# EAGLE design 4 layerer PCB Electronics Design (EAGLE 9.7.0)
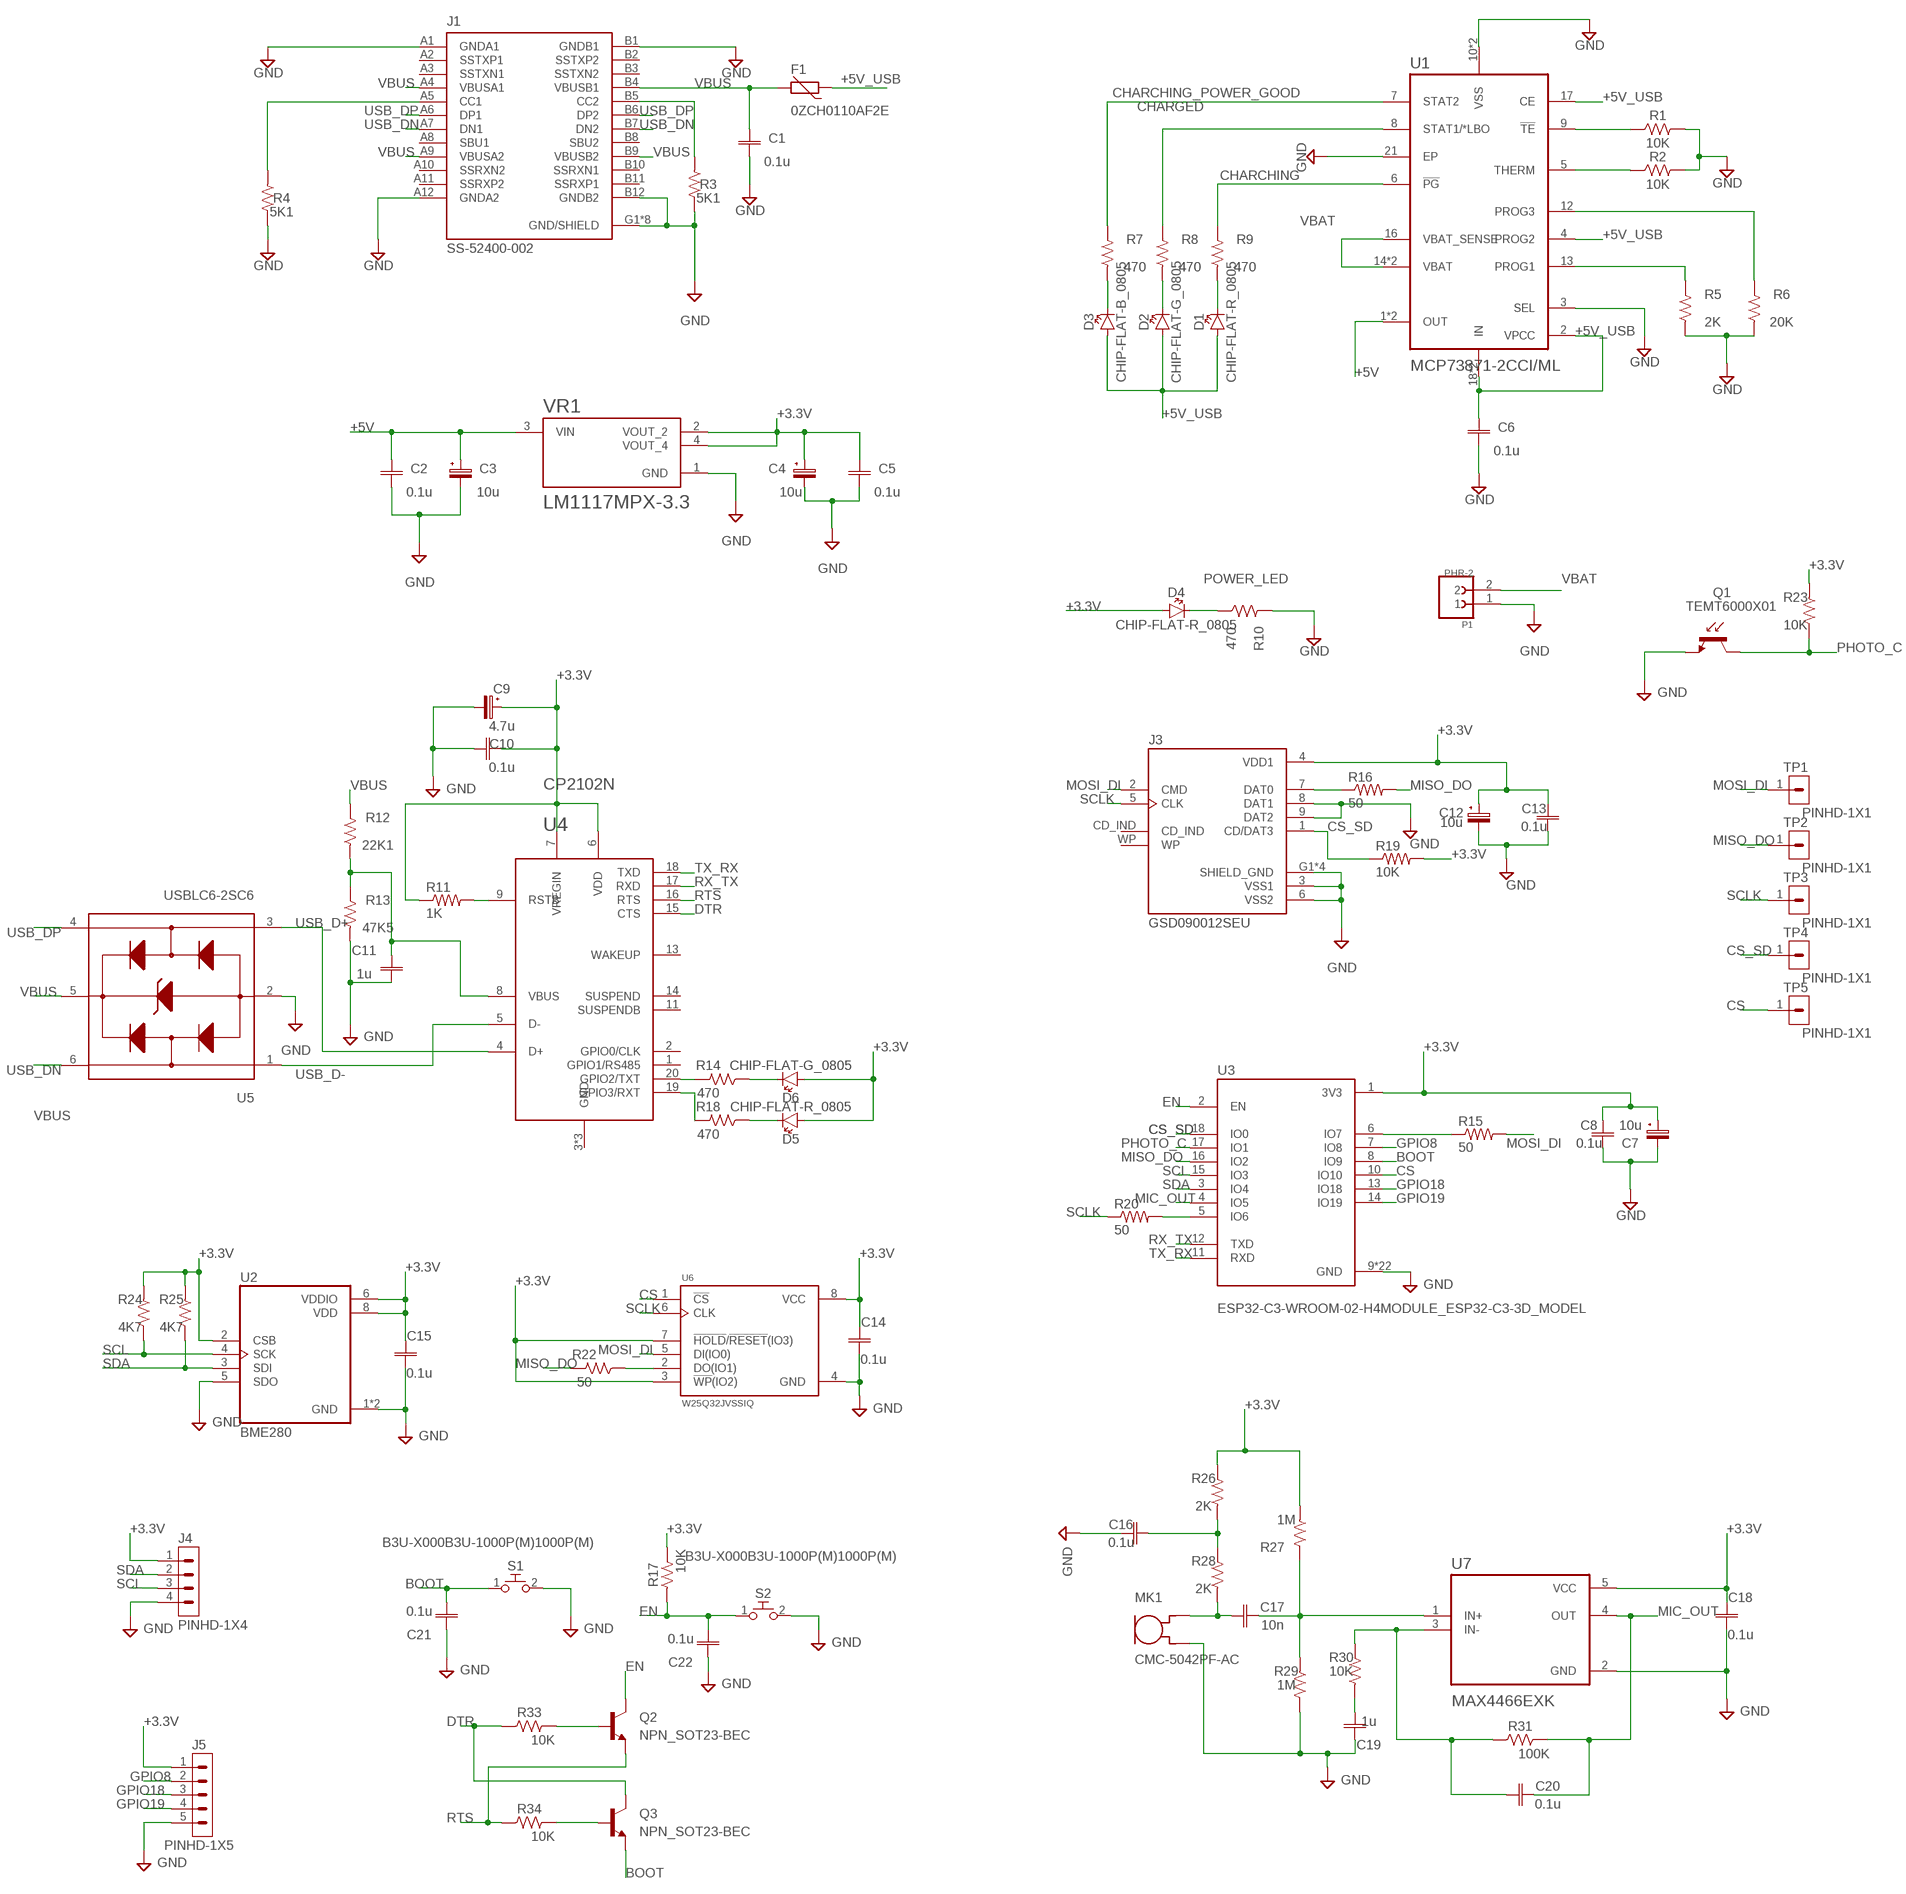
[diagram p0: schematic, sheet 1]

## Parts
C1  0.1u  C_CHIP-0805(2012-METRIC)  [CAPC2012X110]
C2  0.1u  C_CHIP-0805(2012-METRIC)  [CAPC2012X110]
C3  10u  C-POL_TANTALUM-1206(3216-METRIC)  [CAPMP3216X180N]
C4  10u  C-POL_TANTALUM-1206(3216-METRIC)  [CAPMP3216X180N]
C5  0.1u  C_CHIP-0805(2012-METRIC)  [CAPC2012X110]
C6  0.1u  C_CHIP-0805(2012-METRIC)  [CAPC2012X110]
C7  10u  C-POL_TANTALUM-1206(3216-METRIC)  [CAPMP3216X180N]
C8  0.1u  C_CHIP-0805(2012-METRIC)  [CAPC2012X110]
C9  4.7u  C-POL_TANTALUM-1206(3216-METRIC)  [CAPMP3216X180N]
C10  0.1u  C_CHIP-0805(2012-METRIC)  [CAPC2012X110]
C11  1u  C_CHIP-0805(2012-METRIC)  [CAPC2012X110]
C12  10u  C-POL_TANTALUM-1206(3216-METRIC)  [CAPMP3216X180N]
C13  0.1u  C_CHIP-0805(2012-METRIC)  [CAPC2012X110]
C14  0.1u  C_CHIP-0805(2012-METRIC)  [CAPC2012X110]
C15  0.1u  C_CHIP-0805(2012-METRIC)  [CAPC2012X110]
C16  0.1u  C_CHIP-0805(2012-METRIC)  [CAPC2012X110]
C17  10n  C_CHIP-0805(2012-METRIC)  [CAPC2012X110]
C18  0.1u  C_CHIP-0805(2012-METRIC)  [CAPC2012X110]
C19  1u  C_CHIP-0805(2012-METRIC)  [CAPC2012X110]
C20  0.1u  C_CHIP-0805(2012-METRIC)  [CAPC2012X110]
C21  0.1u  C_CHIP-0805(2012-METRIC)  [CAPC2012X110]
C22  0.1u  C_CHIP-0805(2012-METRIC)  [CAPC2012X110]
D1  CHIP-FLAT-R_0805  [LEDC2012X110N_FLAT-R]
D2  CHIP-FLAT-G_0805  [LEDC2012X110N_FLAT-G]
D3  CHIP-FLAT-B_0805  [LEDC2012X110N_FLAT-B]
D4  CHIP-FLAT-R_0805  [LEDC2012X110N_FLAT-R]
D5  CHIP-FLAT-R_0805  [LEDC2012X110N_FLAT-R]
D6  CHIP-FLAT-G_0805  [LEDC2012X110N_FLAT-G]
F1  0ZCH0110AF2E  [FUSC3225X100N]
J1  SS-52400-002  [BELFUSE_SS-52400-002]
J3  GSD090012SEU  [AMPHENOL_GSD090012SEU]
J4  PINHD-1X4  [1X04]
J5  PINHD-1X5  [1X05]
MK1  CMC-5042PF-AC  [CUI_CMC-5042PF-AC]
P1  PHR-2  [JST_PHR-2]
Q1  TEMT6000X01  [1206_TEMT6000X01]
Q2  NPN_SOT23-BEC  [SOT95P237X112-3N]
Q3  NPN_SOT23-BEC  [SOT95P237X112-3N]
R1  10K  R-US_CHIP-0805(2012-METRIC)  [RESC2012X65]
R2  10K  R-US_CHIP-0805(2012-METRIC)  [RESC2012X65]
R3  5K1  R-US_CHIP-0805(2012-METRIC)  [RESC2012X65]
R4  5K1  R-US_CHIP-0805(2012-METRIC)  [RESC2012X65]
R5  2K  R-US_CHIP-0805(2012-METRIC)  [RESC2012X65]
R6  20K  R-US_CHIP-0805(2012-METRIC)  [RESC2012X65]
R7  470  R-US_CHIP-0805(2012-METRIC)  [RESC2012X65]
R8  470  R-US_CHIP-0805(2012-METRIC)  [RESC2012X65]
R9  470  R-US_CHIP-0805(2012-METRIC)  [RESC2012X65]
R10  470  R-US_CHIP-0805(2012-METRIC)  [RESC2012X65]
R11  1K  R-US_R0805  [R0805]
R12  22K1  R-US_CHIP-0805(2012-METRIC)  [RESC2012X65]
R13  47K5  R-US_CHIP-0805(2012-METRIC)  [RESC2012X65]
R14  470  R-US_CHIP-0805(2012-METRIC)  [RESC2012X65]
R15  50  R-US_R0805  [R0805]
R16  50  R-US_R0805  [R0805]
R17  10K  R-US_CHIP-0805(2012-METRIC)  [RESC2012X65]
R18  470  R-US_CHIP-0805(2012-METRIC)  [RESC2012X65]
R19  10K  R-US_R0805  [R0805]
R20  50  R-US_R0805  [R0805]
R22  50  R-US_CHIP-0805(2012-METRIC)  [RESC2012X65]
R23  10K  R-US_CHIP-0805(2012-METRIC)  [RESC2012X65]
R24  4K7  R-US_CHIP-0805(2012-METRIC)  [RESC2012X65]
R25  4K7  R-US_CHIP-0805(2012-METRIC)  [RESC2012X65]
R26  2K  R-US_CHIP-0805(2012-METRIC)  [RESC2012X65]
R27  1M  R-US_CHIP-0805(2012-METRIC)  [RESC2012X65]
R28  2K  R-US_CHIP-0805(2012-METRIC)  [RESC2012X65]
R29  1M  R-US_CHIP-0805(2012-METRIC)  [RESC2012X65]
R30  10K  R-US_CHIP-0805(2012-METRIC)  [RESC2012X65]
R31  100K  R-US_CHIP-0805(2012-METRIC)  [RESC2012X65]
R33  10K  R-US_CHIP-0805(2012-METRIC)  [RESC2012X65]
R34  10K  R-US_CHIP-0805(2012-METRIC)  [RESC2012X65]
S1  B3U-X000B3U-1000P(M)1000P(M)  [B3U-1000P(M)]
S2  B3U-X000B3U-1000P(M)1000P(M)  [B3U-1000P(M)]
TP1  PINHD-1X1  [1X01]
TP2  PINHD-1X1  [1X01]
TP3  PINHD-1X1  [1X01]
TP4  PINHD-1X1  [1X01]
TP5  PINHD-1X1  [1X01]
U1  MCP73871-2CCI/ML  [QFN50P400X400X100-21N]
U2  BME280  [PSON65P250X250X100-8N]
U3  ESP32-C3-WROOM-02-H4MODULE_ESP32-C3-3D_MODEL  [MODULE_ESP32-C3-WROOM-02-H4]
U4  CP2102N-A02-GQFN20  [WFQFN-20]
U5  USBLC6-2SC6  [SOT95P280X145-6N]
U6  W25Q32JVSSIQ  [SOIC127P790X216-8N]
U7  MAX4466EXK  [SOT65P210X110-5N]
VR1  LM1117MPX-3.3  [VREG_LM1117MPX-3.3]

## Nets
+3.3V [3.3V]: C4.1(+) C5.1 C7.1(+) C8.2 C9.1(+) C10.1 C12.1(+) C13.2 C14.1 C15.1 C18.1 D4.A D5.A D6.A J3.4(VDD1) J4.1 J5.1 R11.1 R17.2 R19.2 R23.1 R24.1 R25.1 R26.2 R27.1 U2.2(CSB) U2.6(VDDIO) U2.8(VDD) U3.1(3V3) U4.6(VDD) U4.7(VREGIN) U6.3(!WP!(IO2)) U6.7(!HOLD!/!RESET!(IO3)) U6.8(VCC) U7.5(VCC) VR1.2(VOUT_2) VR1.4(VOUT_4)
+5V [5V_USB]: C2.1 C3.1(+) U1.1(OUT) U1.20(OUT) VR1.3(VIN)
+5V_USB [5V_USB]: C6.1 D1.A D2.A D3.A F1.1 U1.2(VPCC) U1.4(PROG2) U1.17(CE) U1.18(IN) U1.19(IN)
BOOT [control]: C21.1 Q3.2(E) S1.1 U3.8(IO9)
CHARCHING: R9.2 U1.6(!PG)
CHARCHING_POWER_GOOD: R7.2 U1.7(STAT2)
CHARGED: R8.2 U1.8(STAT1/*LBO)
CS [SPI]: TP5.1 U3.10(IO10) U6.1(!CS)
CS_SD: J3.1(CD/DAT3) R19.1 TP4.1 U3.18(IO0)
DTR: Q3.3(C) R33.1 U4.15(CTS)
EN [control]: C22.1 Q2.3(C) R17.1 S2.1 U3.2(EN)
GND [GND]: C1.2 C2.2 C3.2(-) C4.2(-) C5.2 C6.2 C7.2(-) C8.1 C9.2(-) C10.2 C11.2 C12.2(-) C13.1 C14.2 C15.2 C16.1 C18.2 C19.2 C21.2 C22.2 J1.A1(GNDA1) J1.A12(GNDA2) J1.B1(GNDB1) J1.B12(GNDB2) J1.G1(GND/SHIELD) J1.G2(GND/SHIELD) J1.G3(GND/SHIELD) J1.G4(GND/SHIELD) J1.S1(GND/SHIELD) J1.S2(GND/SHIELD) J1.S3(GND/SHIELD) J1.S4(GND/SHIELD) J3.3(VSS1) J3.6(VSS2) J3.8(DAT1) J3.9(DAT2) J3.G1(SHIELD_GND) J3.G2(SHIELD_GND) J3.G3(SHIELD_GND) J3.G4(SHIELD_GND) J4.4 J5.5 MK1.GND P1.1 Q1.P$1(E) R1.2 R2.2 R3.2 R4.2 R5.1 R6.1 R10.2 R13.1 R29.2 S1.2 S2.2 U1.3(SEL) U1.10(VSS) U1.11(VSS) U1.21(EP) U2.1(GND) U2.5(SDO) U2.7(GND) U3.9(GND) U3.19(GND) U3.20(GND) U3.21(GND) U3.22(GND) U3.23(GND) U3.24(GND) U3.25(GND) U3.26(GND) U3.27(GND) U3.28(GND) U3.29(GND) U3.30(GND) U3.31(GND) U3.32(GND) U3.33(GND) U3.34(GND) U3.35(GND) U3.36(GND) U3.37(GND) U3.38(GND) U3.39(GND) U5.2(GND) U6.4(GND) U7.2(GND) VR1.1(GND)
GPIO8 [GPIO]: J5.2 U3.7(IO8)
GPIO18 [GPIO]: J5.3 U3.13(IO18)
GPIO19 [GPIO]: J5.4 U3.14(IO19)
MIC_OUT: C20.2 R31.2 U3.4(IO5) U7.4(OUT)
MISO_DO [SPI]: R16.2 R22.2 TP2.1 U3.16(IO2)
MOSI_DI [SPI]: J3.2(CMD) R15.2 TP1.1 U6.5(DI(IO0))
N$1: J1.B5(CC2) R3.1
N$2: J1.A5(CC1) R4.1
N$3: R1.1 U1.9(!TE)
N$4: R6.2 U1.12(PROG3)
N$5: R2.1 U1.5(THERM)
N$6: R5.2 U1.13(PROG1)
N$7: R11.2 U4.9(RSTB)
N$8: D6.C R14.1
N$9: C11.1 R12.1 R13.2 U4.8(VBUS)
N$10: D3.C R7.1
N$11: D2.C R8.1
N$12: R15.1 U3.6(IO7)
N$13: D1.C R9.1
N$14 [GND]: C20.1 R30.2 R31.1 U7.3(IN-)
N$15: D5.C R18.1
N$16: R14.2 U4.20(GPIO2/TXT)
N$17: R18.2 U4.19(GPIO3/RXT)
N$18: Q2.1(B) R33.2
N$19: R20.2 U3.5(IO6)
N$20: Q3.1(B) R34.2
N$21: C16.2 R26.1 R28.2
N$22: J3.7(DAT0) R16.1
N$23: C17.2 R27.2 R29.1 U7.1(IN+)
N$24: C17.1 MK1.OUT R28.1
N$25: R22.1 U6.2(DO(IO1))
N$26: C19.1 R30.1
PHOTO_C: Q1.P$3(C) R23.2 U3.17(IO1)
POWER_LED: D4.C R10.1
RTS [control]: Q2.2(E) R34.1 U4.16(RTS)
RX_TX: U3.12(TXD) U4.17(RXD)
SCL [I2C]: J4.3 R24.2 U2.4(SCK) U3.15(IO3)
SCLK [SPI]: J3.5(CLK) R20.1 TP3.1 U6.6(CLK)
SDA [I2C]: J4.2 R25.2 U2.3(SDI) U3.3(IO4)
TX_RX: U3.11(RXD) U4.18(TXD)
USB_D+ [USB_data]: U4.4(D+) U5.3(I/O2_IN)
USB_D- [USB_data]: U4.5(D-) U5.1(I/O1_IN)
USB_DN [USB_data]: J1.A7(DN1) J1.B7(DN2) U5.6(I/O1_OUT)
USB_DP [USB_data]: J1.A6(DP1) J1.B6(DP2) U5.4(I/O2_OUT)
VBAT [VBUS]: P1.2 U1.14(VBAT) U1.15(VBAT) U1.16(VBAT_SENSE)
VBUS [VBUS]: C1.1 F1.2 J1.A4(VBUSA1) J1.A9(VBUSA2) J1.B4(VBUSB1) J1.B9(VBUSB2) R12.2 U5.5(VBUS)
Unconnected: J1.A2(SSTXP1) J1.A3(SSTXN1) J1.A8(SBU1) J1.A10(SSRXN2) J1.A11(SSRXP2) J1.B2(SSTXP2) J1.B3(SSTXN2) J1.B8(SBU2) J1.B10(SSRXN1) J1.B11(SSRXP1) J3.CD_IND J3.WP U4.1(GPIO1/RS485) U4.2(GPIO0/CLK) U4.3(GND) U4.11(SUSPENDB) U4.12(GND) U4.13(WAKEUP) U4.14(SUSPEND) U4.GND

## Library data of the parts
C1 C2 C5 C6 C8 C10 C11 C13-C22 = Capacitor:C: Capacitor - Generic
C3 C4 C7 C9 C12 = Capacitor:C-POL: Capacitor Polarised - Generic
D1 D4 D5 = LED:CHIP-FLAT-R: Red LED - Generic
D2 D6 = LED:CHIP-FLAT-G: Green LED - Generic
D3 = LED:CHIP-FLAT-B: Blue LED - Generic
F1 = 0ZCH0110AF2E:0ZCH0110AF2E: Check availability <https://pricing.snapeda.com/parts/0ZCH0110AF2E/Bel%20Fuse%20Inc./view-part?ref=eda>
J1 = SS-52400-002:SS-52400-002: Check availability <https://pricing.snapeda.com/parts/SS-52400-002/Stewart%20Connector/view-part?ref=eda>
J3 = GSD090012SEU:GSD090012SEU: Check availability <https://pricing.snapeda.com/parts/GSD090012SEU/Amphenol%20FCI/view-part?ref=eda>
J4 = Connector:PINHD-1X4: Pin Header
J5 = Connector:PINHD-1X5: Pin Header
MK1 = CMC-5042PF-AC:CMC-5042PF-AC: Check availability <https://pricing.snapeda.com/parts/CMC-5042PF-AC/Same%20Sky/view-part?ref=eda>
P1 = PHR-2:PHR-2: Check availability <https://pricing.snapeda.com/parts/PHR-2/JST%20Sales/view-part?ref=eda>
Q1 = Sensor:TEMT6000X01: Ambient Light Sensor Datasheet <https://www.vishay.com/docs/81579/temt6000.pdf>
Q2 Q3 = Transistor:NPN: NPN Transistor - Generic
R1-R10 R12-R14 R17 R18 R22-R31 R33 R34 = Resistor:R-US: Resistor Fixed - ANSI
R11 R15 R16 R19 R20 = AtoZ v7:R-US_: RESISTOR, American symbol
S1 S2 = Switch:B3U-X000: Ultra-small Tactile Switch Contact form : SPST-NO Reference: Datasheet <https://omronfs.omron.com/en_US/ecb/products/pdf/en-b3u.pdf>
TP1-TP5 = Connector:PINHD-1X1: Pin Header
U1 = MCP73871-2CCI_ML:MCP73871-2CCI/ML: Check availability <https://pricing.snapeda.com/parts/MCP73871-2CCI/ML/Microchip%20Technology/view-part?ref=eda>
U2 = BME280:BME280: Check availability <https://pricing.snapeda.com/parts/BME280/Bosch/view-part?ref=eda>
U3 = ESP32-C3-WROOM-02-H4:ESP32-C3-WROOM-02-H4: Check availability <https://pricing.snapeda.com/parts/ESP32-C3-WROOM-02-H4/Espressif%20Systems/view-part?ref=eda>
U4 = CP2102N-A02-GQFN20:CP2102N-A02-GQFN20: Check availability <https://pricing.snapeda.com/parts/CP2102N-A02-GQFN20/Silicon%20Labs/view-part?ref=eda>
U5 = USBLC6-2SC6:USBLC6-2SC6: Check availability <https://pricing.snapeda.com/parts/USBLC6-2SC6/STMicroelectronics/view-part?ref=eda>
U6 = W25Q32JVSSIQ:W25Q32JVSSIQ: Check availability <https://pricing.snapeda.com/parts/W25Q32JVSSIQ/Winbond/view-part?ref=eda>
U7 = MAX4466EXK:MAX4466EXK: Check availability <https://pricing.snapeda.com/parts/MAX4466EXK%2BT/Maxim%20Integrated%20Products/view-part?ref=eda>
VR1 = LM1117MPX-3.3:LM1117MPX-3.3: Check availability <https://pricing.snapeda.com/parts/LM1117MPX-3.3/Texas%20Instruments/view-part?ref=eda>

## Net classes
3 VBUS: width 0.5 mm
4 USB_data: width 0.25 mm
9 5V_USB: width 0.5 mm
10 3.3V: width 0.3 mm

## Board
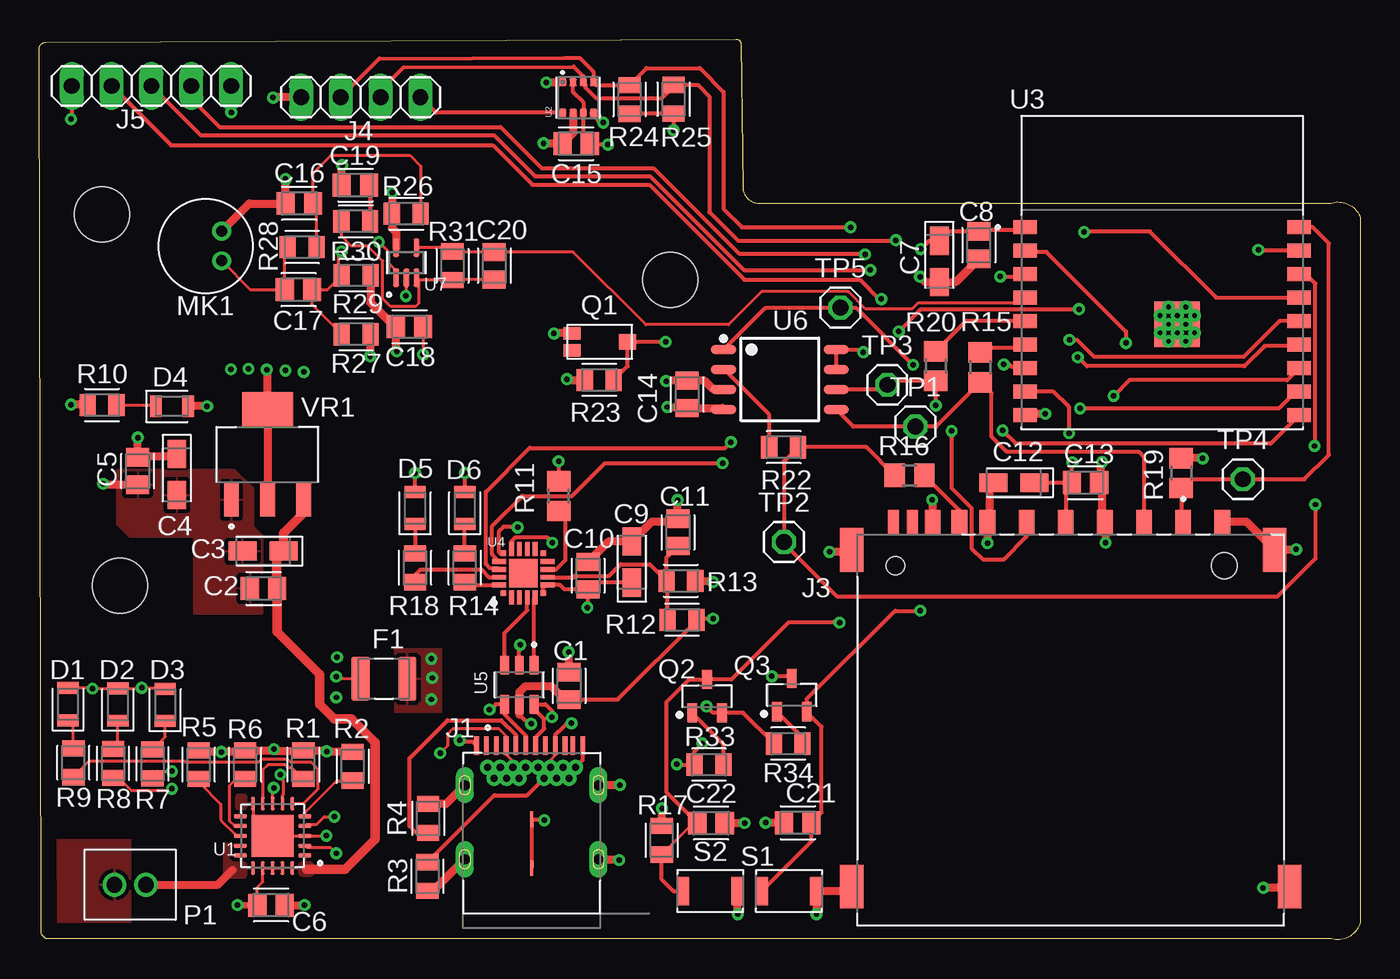
[diagram p1: board, top side]
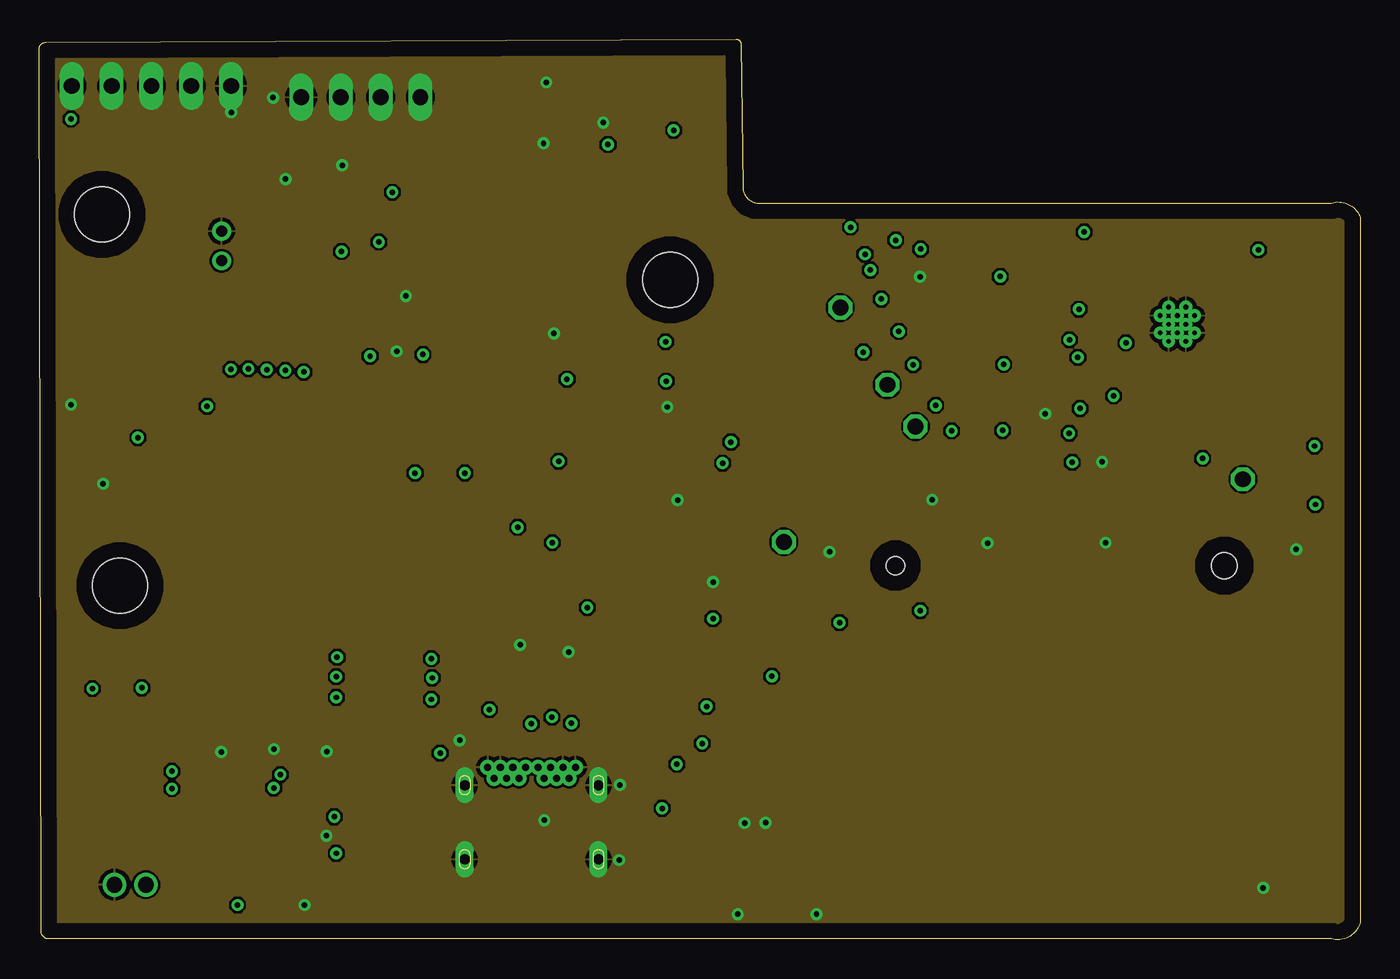
[diagram p2: board, inner layer Route2]
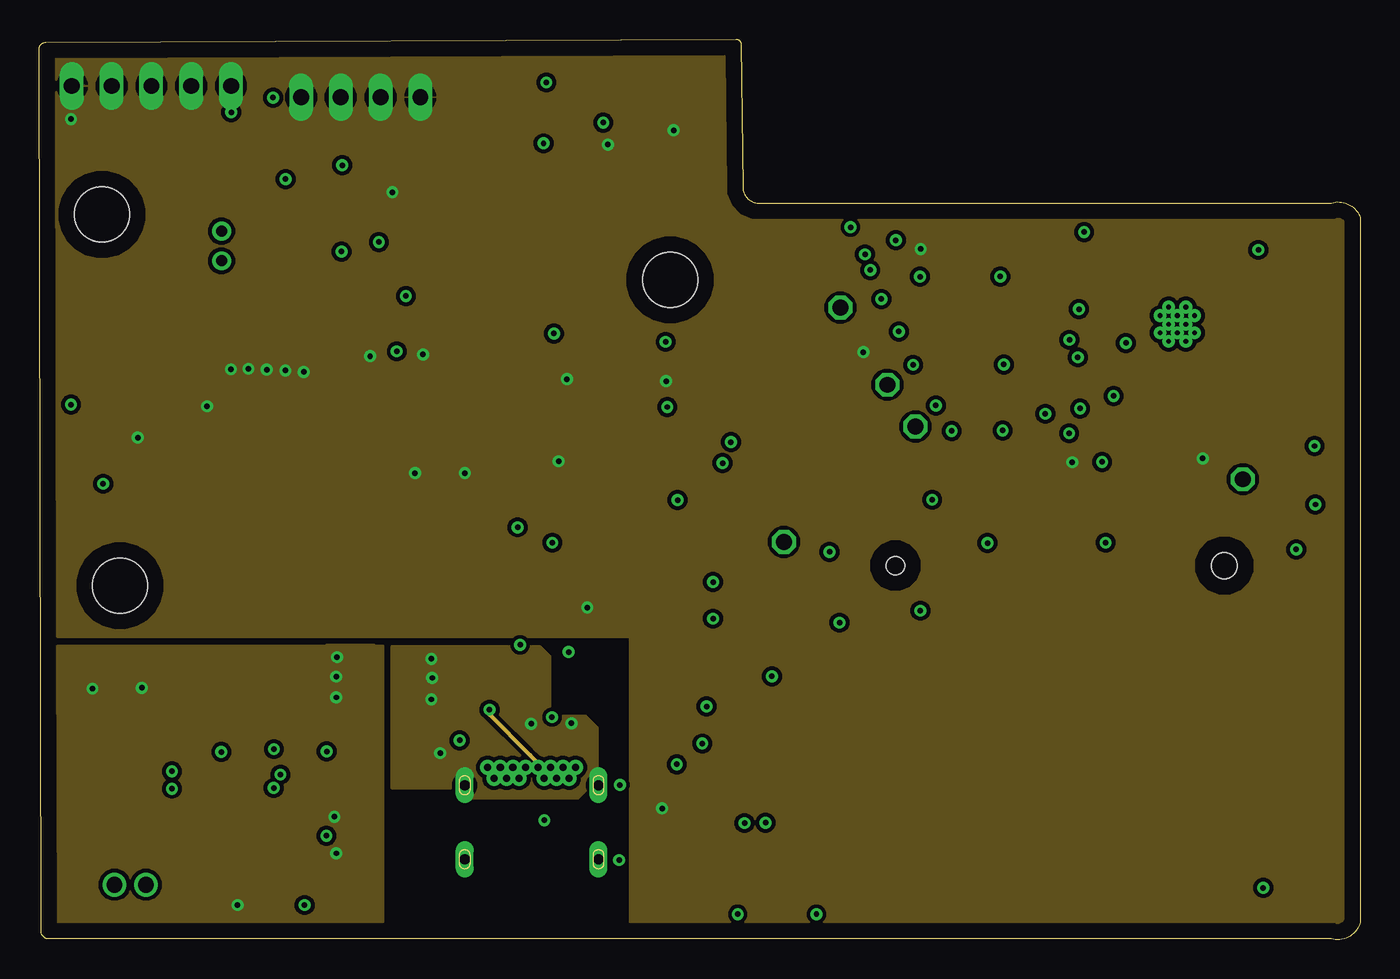
[diagram p3: board, inner layer Route63]
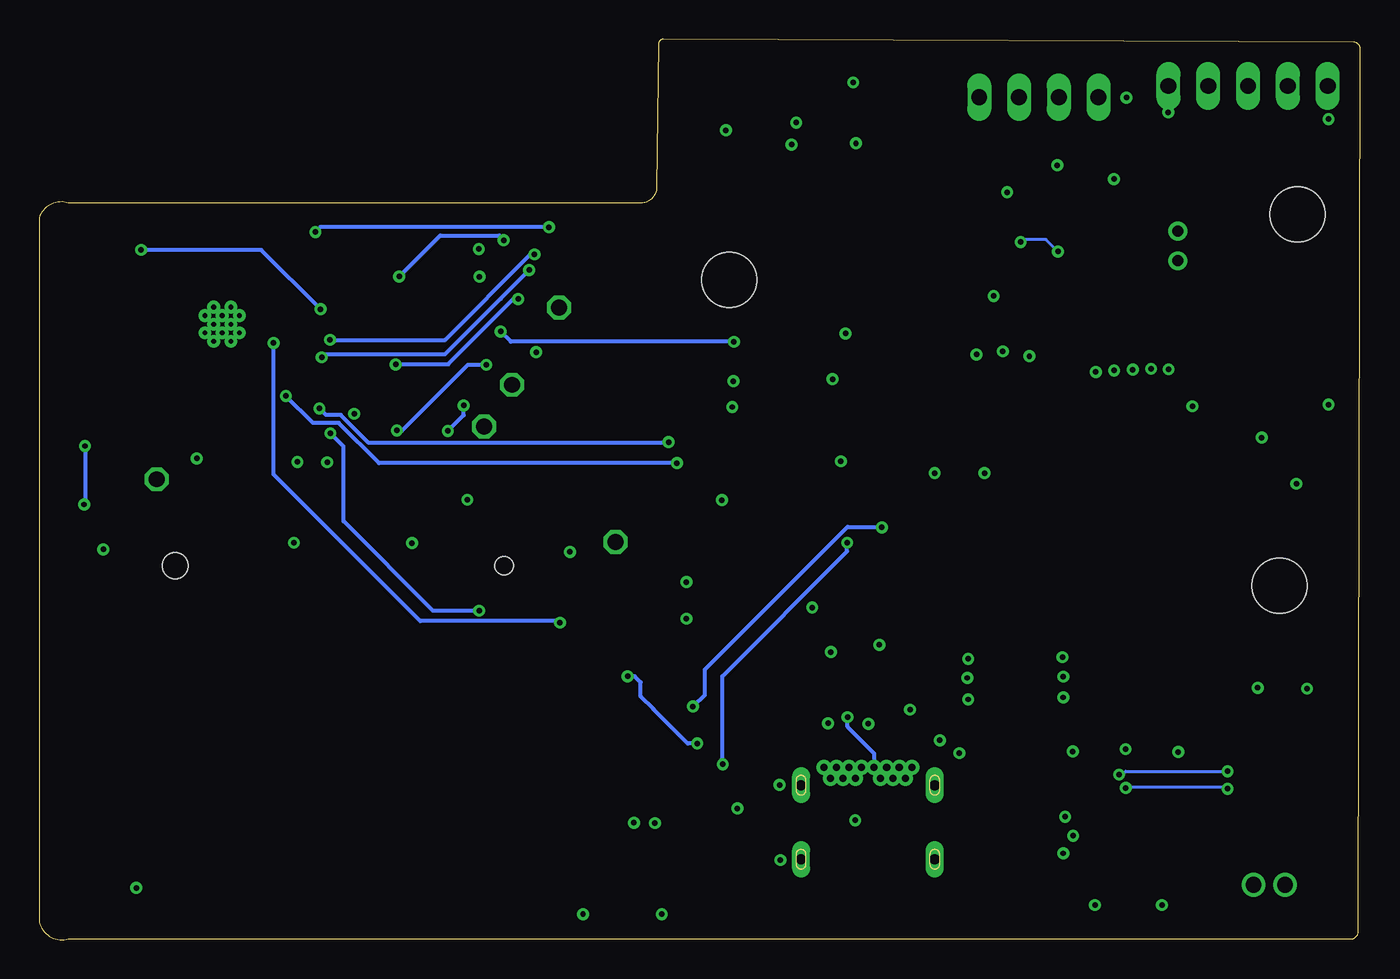
[diagram p4: board, bottom side, seen from below]

Size 84.36 x 57.51 mm. Coordinates in mm from the lower left corner, seen from the top.
Outline: 45.94,47.05 82.49,47.05 arc-90 84.36,46.1 84.36,1.11 arc-90 82.49,0.06 0.6,0.06 arc-90 0.13,0.52 0.13,0.85 0,56.87 arc-90 0.43,57.31 44.5,57.51 arc-89 44.81,57.2 44.94,48.05 arc90 45.94,47.05
Copper layers (1+2*15+16): Top / Route2 / Route63 / Bottom
Stack-up 4 Layer Stack: Top SilkScreen Epoxy Ink / Top SolderMask SR:Green 0.0254mm Dk 4.3 / Top Surface Finish Lead-Free 0.02mm / Top CuFoil:007 0.035mm / Dielectric-1 Prepreg:001 0.064mm / Dielectric-2 Prepreg:001 0.064mm / Route2 CuFoil:007 0.035mm / Dielectric-3 Core:066 0.711mm / Route63 CuFoil:007 0.035mm / Dielectric-4 Prepreg:001 0.064mm / Dielectric-5 Prepreg:001 0.064mm / Bottom CuFoil:007 0.035mm / Bottom Surface Finish Lead-Free 0.02mm / Bottom SolderMask SR:Green 0.0254mm Dk 4.3 / Bottom SilkScreen Epoxy Ink
Design rules: minimum copper width all 0.2mm, minimum copper width classes=3,9 0.5mm, minimum copper width classes=10 0.3mm, minimum copper width classes=4 0.25mm, minimum copper width 6mil, minimum drill size 0.35mm, copper clearance component=J1 to component=J1 4mil, copper clearance all to all 3mil, copper clearance classes=3,9 to all 0.25mm, copper clearance component=J1 to component=J1 (same net) 0mil, copper clearance wire_polygon to wire_polygon 6mil, copper clearance wire_polygon to pad_smd 6mil, copper clearance wire_polygon to via 6mil, copper clearance pad_smd to pad_smd 6mil, copper clearance pad_smd to via 6mil, copper clearance via to via 6mil, copper clearance smd to pad (same net) 6mil, copper clearance smd to via (same net) 6mil, copper clearance smd to smd (same net) 6mil, dimension clearance 40mil, via restrict clearance 0mil, restrict clearance 0mil, drill distance 6mil, keepout clearance 0mil
Holes 3.5 mm at 4.01,46.31 5.16,22.61 40.28,42.14

### Footprints (pad centres in the part's own frame; a part is rotated, then mirrored left to right if it is on the bottom)
CAPC2012X110 = smd 1.165 x 1.465: 1 -0.875,0; 2 0.875,0
CAPMP3216X180N = smd 1.796 x 1.189: 1 -1.31,0; 2 1.31,0
LEDC2012X110N_FLAT-R = smd 0.762 x 1.362: A 1.025,0; C -1.025,0
LEDC2012X110N_FLAT-G = smd 0.762 x 1.362: A 1.025,0; C -1.025,0
LEDC2012X110N_FLAT-B = smd 0.762 x 1.362: A 1.025,0; C -1.025,0
FUSC3225X100N = smd 1.18 x 2.81: 1 -1.485,0; 2 1.485,0
BELFUSE_SS-52400-002 = smd 0.3 x 1.2: A1 -3.512,7.257; A2 -2.885,7.257; A3 -2.258,7.257; A4 -1.631,7.257; A5 -1.004,7.257; A6 -0.377,7.257; A7 0.25,7.257; A8 0.877,7.257; A9 1.504,7.257; A10 2.131,7.257; A11 2.631,7.257; A12 3.258,7.257 | drill 0.45 pad 0.65: B1 2.8,5.88; B2 2.4,5.17; B3 1.6,5.17; B4 1.2,5.88; B5 0.8,5.17; B6 0.4,5.88; B7 -0.4,5.88; B8 -0.8,5.17; B9 -1.2,5.88; B10 -1.6,5.17; B11 -2.4,5.17; B12 -2.8,5.88; G1 2,5.88; G2 -2,5.88 | smd 0.2 x 1: G3 0,2.55; G4 0,-0.55 | drill 0.65 pad 1.05 long: S1 -4.27,4.73; S2 4.27,4.73; S3 -4.27,0; S4 4.27,0
AMPHENOL_GSD090012SEU = smd 1 x 1.5: 1 6.875,13.3; 2 4.375,13.3; 3 1.875,13.3; 4 -0.625,13.3; 5 -3.125,13.3; 6 -5.625,13.3; 7 -7.415,13.3; 8 -9.115,13.3; 9 9.375,13.3 | smd 0.7 x 1.5: CD_IND -10.415,13.3; WP -11.615,13.3 | smd 1.5 x 2.8: G1 -14.285,11.5; G2 12.72,11.5; G3 13.65,-10; G4 -14.285,-10 | hole 1.15: -11.5,10.5 | hole 1.65: 9.5,10.5
1X04 = drill 1.016 long: 1 -3.81,0; 2 -1.27,0; 3 1.27,0; 4 3.81,0
1X05 = drill 1.016 long: 1 -5.08,0; 2 -2.54,0; 3 0,0; 4 2.54,0; 5 5.08,0
CUI_CMC-5042PF-AC = drill 0.7: GND 1,0.95; OUT 1,-0.95
JST_PHR-2 = drill 1: 1 -1,0; 2 1,0
1206_TEMT6000X01 = smd 1.1 x 0.8: P$1 -1.77,0.55; P$2 -1.77,-0.55 | smd 1.1 x 1: P$3 1.78,0
SOT95P237X112-3N = smd 1.224 x 0.625: 1 -1.064,0.95; 2 -1.064,-0.95; 3 1.064,0
RESC2012X65 = smd 1.031 x 1.42: 1 -0.919,0; 2 0.919,0
R0805 = smd 1.3 x 1.5: 1 -0.95,0; 2 0.95,0
B3U-1000P(M) = smd 0.8 x 1.8: 1 -1.75,0; 2 1.75,0
1X01 = drill 1.016 octagon: 1 0,0
QFN50P400X400X100-21N = smd 0.84 x 0.26: 1 -2.062,1.254; 2 -2.062,0.627; 3 -2.062,0; 4 -2.062,-0.627; 5 -2.062,-1.254; 11 2.062,-1.254; 12 2.062,-0.627; 13 2.062,0; 14 2.062,0.627; 15 2.062,1.254 | smd 0.26 x 0.84: 6 -1.254,-2.062; 7 -0.627,-2.062; 8 0,-2.062; 9 0.627,-2.062; 10 1.254,-2.062; 16 1.254,2.062; 17 0.627,2.062; 18 0,2.062; 19 -0.627,2.062; 20 -1.254,2.062 | smd 2.7 x 2.7: 21 0,0
PSON65P250X250X100-8N = smd 0.49 x 0.45: 1 0.97,0.975; 2 0.97,0.325; 3 0.97,-0.325; 4 0.97,-0.975; 5 -0.97,-0.975; 6 -0.97,-0.325; 7 -0.97,0.325; 8 -0.97,0.975
MODULE_ESP32-C3-WROOM-02-H4 = smd 1.5 x 0.9: 1 -8.75,2.9; 2 -8.75,1.4; 3 -8.75,-0.1; 4 -8.75,-1.6; 5 -8.75,-3.1; 6 -8.75,-4.6; 7 -8.75,-6.1; 8 -8.75,-7.6; 9 -8.75,-9.1; 10 8.75,-9.1; 11 8.75,-7.6; 12 8.75,-6.1; 13 8.75,-4.6; 14 8.75,-3.1; 15 8.75,-1.6; 16 8.75,-0.1; 17 8.75,1.4; 18 8.75,2.9 | smd 0.7 x 0.7: 19 -0.14,-2.2; 20 0.96,-2.2; 21 2.06,-2.2; 22 -0.14,-3.3; 23 0.96,-3.3; 24 2.06,-3.3; 25 -0.14,-4.4; 26 0.96,-4.4; 27 2.06,-4.4 | drill 0.3 pad 0.4: 28 0.41,-2.2; 29 1.51,-2.2; 30 -0.14,-2.75; 31 0.96,-2.75; 32 2.06,-2.75; 33 0.41,-3.3; 34 1.51,-3.3; 35 -0.14,-3.85; 36 0.96,-3.85; 37 2.06,-3.85; 38 0.41,-4.4; 39 1.51,-4.4
WFQFN-20 = smd 0.35 x 0.35: 1 -1.275,1.275; 6 -1.275,-1.275; 11 1.275,-1.275; 16 1.275,1.275 | smd 0.9 x 0.3: 2 -1.55,0.75; 3 -1.55,0.25; 4 -1.55,-0.25; 5 -1.55,-0.75; 12 1.55,-0.75; 13 1.55,-0.25; 14 1.55,0.25; 15 1.55,0.75 | smd 0.3 x 0.9: 7 -0.75,-1.55; 8 -0.25,-1.55; 9 0.25,-1.55; 10 0.75,-1.55; 17 0.75,1.55; 18 0.25,1.55; 19 -0.25,1.55; 20 -0.75,1.55 | smd 1.8 x 1.8: GND 0,0
SOT95P280X145-6N = smd 1.21 x 0.59: 1 -1.255,0.95; 2 -1.255,0; 3 -1.255,-0.95; 4 1.255,-0.95; 5 1.255,0; 6 1.255,0.95
SOIC127P790X216-8N = smd 1.6 x 0.6: 1 -3.6,1.905; 2 -3.6,0.635; 3 -3.6,-0.635; 4 -3.6,-1.905; 5 3.6,-1.905; 6 3.6,-0.635; 7 3.6,0.635; 8 3.6,1.905
SOT65P210X110-5N = smd 1.19 x 0.4: 1 -0.96,0.65; 2 -0.96,0; 3 -0.96,-0.65; 4 0.96,-0.65; 5 0.96,0.65
VREG_LM1117MPX-3.3 = smd 2.15 x 0.95: 1 -2.9,2.3; 2 -2.9,0; 3 -2.9,-2.3 | smd 2.15 x 3.25: 4 2.9,0

### Placement (x,y rotation side)
C1  33.83,16.21 90 top
C2  14.32,22.43 180 top
C3  14.3,24.82 180 top
C4  8.79,29.7 270 top
C5  6.3,29.93 270 top
C6  14.81,2.21 0 top
C7  57.48,43.31 270 top
C8  59.99,44.35 90 top
C9  37.85,24.11 90 top
C10  35.05,23.25 90 top
C11  40.79,26.01 90 top
C12  62.23,29.19 180 top
C13  66.81,29.19 180 top
C14  41.38,34.83 270 top
C15  34.29,50.83 180 top
C16  16.61,47.02 0 top
C17  16.56,41.51 0 top
C18  23.65,39.15 180 top
C19  20.19,48.19 180 top
C20  29.06,43.03 90 top
C21  48.44,7.47 180 top
C22  42.9,7.45 0 top
D1  1.85,15.04 90 top
D2  5.03,15.02 90 top
D3  8.05,14.99 90 top
D4  8.48,34.07 0 top
D5  24,27.56 90 top
D6  27.18,27.56 90 top
F1  22.02,16.67 0 top
J1  31.44,5.14 0 top
J3  66.17,13.39 0 top
J4  20.53,53.8 180 top
J5  7.17,54.52 0 top
MK1  10.64,44.3 0 top
P1  5.82,3.51 0 top
Q1  35.79,38.18 0 top
Q2  42.65,15.55 90 top
Q3  48.06,15.63 90 top
R1  16.86,11.18 90 top
R2  20.01,11.08 90 top
R3  24.79,4.04 270 top
R4  24.84,7.75 90 top
R5  10.18,11.18 270 top
R6  13.16,11.18 270 top
R7  7.24,11.23 270 top
R8  4.72,11.26 270 top
R9  2.18,11.31 270 top
R10  4.01,34.14 180 top
R11  33.17,28.33 270 top
R12  41.05,20.43 0 top
R13  40.97,22.92 180 top
R14  27.18,23.75 270 top
R15  60.1,36.56 270 top
R16  55.57,29.65 180 top
R17  39.75,6.35 90 top
R18  24,23.75 270 top
R19  72.92,29.8 90 top
R20  57.25,36.63 90 top
R22  47.54,31.45 0 top
R23  35.76,35.74 0 top
R24  37.69,53.66 90 top
R25  40.51,53.67 90 top
R26  23.44,46.36 180 top
R27  20.24,38.66 180 top
R28  16.79,44.23 0 top
R29  20.24,42.42 0 top
R30  20.22,45.88 180 top
R31  26.39,43.03 90 top
R33  42.77,11.18 0 top
R34  47.83,12.52 0 top
S1  47.88,3.1 0 top
S2  42.85,3.1 0 top
TP1  55.96,32.77 0 top
TP2  47.55,25.4 0 top
TP3  54.15,35.44 0 top
TP4  76.86,29.4 0 top
TP5  51.15,40.37 0 top
U1  14.91,6.63 180 top
U2  34.42,53.78 90 top
U3  71.71,42.6 0 top
U4  30.91,23.4 90 top
U5  30.66,16.29 270 top
U6  47.29,35.77 0 top
U7  23.44,43.24 90 top
VR1  14.58,30.99 90 top

### Tracks (layer width: path | path; a pad name or v marks a point on that pad's centre or on a via)
+3.3V  (via drill 0.35)
  Top 0.2: C5.1 6.3,30.84 | C4.1 8.62,30.84 | v21.13,37.27 21.16,37.3 | 22.52,47.7 v22.55,47.73 | v39.78,8.39 39.75,8.36 | C18.1 24.52,37.38 v24.51,37.37
  Top 0.254: D5.A v24,29.8 | v27.18,29.8 D6.A | v33.17,30.56 R11.1 | C10.1 35.48,22.8 C9.1 | U4.6 32.19,22.45 32.38,22.65 U4.7 33.26,22.65 33.54,22.37 C10.1 | v36.32,50.78 35.22,50.78 C15.1 34.74,51.25 U2.6 34.75,53.47 34.09,54.13 U2.2 | R24.1 40.49,52.74 R25.1 v40.51,51.7 v40.51,51.69 | 40.07,35.7 v40.03,35.67 | U6.7 U6.8 52.47,37.68 v52.63,37.52 | U3.1 62.76,45.3 60.07,45.3 C8.2 58.08,45.23 C7.1 56.81,44.62 v56.29,44.1 | U2.8 25.33,52.81 J4.1 | J5.1 2.09,52.46 v2.03,52.4 | J3.4 65.55,28.8 C13.2 | C12.1 C13.2 | C13.2 65.93,30.46 v65.96,30.48 | C10.1 35,22.32 v35,21.21
  Top 0.5: v10.72,34.07 D4.A | v6.3,32.06 6.3,30.84 8.62,30.84 | VR1.2 VR1.4 14.58,36.35 v14.53,36.4 | 21.16,37.3 R27.1 | 22.52,47.7 R26.2 22.52,45.45 22.79,45.18 U7.5 | 39.75,8.36 R17.2 | R23.1 33.76,35.74 v33.71,35.79 | U6.3 43.05,35.14 42.48,35.7 C14.1 40.07,35.7 | R19.2 74.28,30.75 v74.29,30.74
  other vias: 12.24,36.43 13.36,36.45 15.72,36.35 16.89,36.25
  pour Route63 (isolate 0.254): -0.74,58.27 -0.74,19.28 37.64,19.28 37.67,19.31 37.67,-0.86 37.64,-0.88 84.25,-0.88 84.28,-0.86 84.28,58.27
  pour Route63: 11.43,37.24 11.43,32.16 17.83,32.16 17.83,37.24
+5V
  Top 0.6: VR1.3 16.88,27.26 15.61,25.99 C3.1 15.18,24.39 15.18,22.46 C2.1 15.2,19.64 17.91,16.93 17.91,15.02 18.82,14.1 19.94,14.1 21.44,12.6 21.44,6.41 19.53,4.5 17.07,4.5
  pour Top: 15.8,5.14 15.8,4.02 17.55,4.02 17.55,5.75 17.53,5.77 16.48,5.77 16.48,5.14
+5V_USB  (via drill 0.35)
  Top 0.2: C6.1 13.93,3.35 14.28,3.7 U1.17 U1.18 U1.19 | D1.A 3.37,16.07 v3.4,16.03 v3.41,16.04 D2.A 6.51,16.04 v6.55,16.08 7.98,16.08 D3.A | F1.1 19.1,16.67 v18.97,16.79 | U1.4 17.09,7.38 17.73,7.38 18.2,7.85 v18.85,7.85 | U1.2 17.1,5.88 18.61,5.88 v18.97,5.52
  Top 0.4: C6.1 v12.67,2.21
  other vias: 19.02,18.04 18.97,15.47
  pour Route63 (isolate 0.254): -0.76,18.83 -0.76,-0.22 21.51,-0.22 22.02,0.28 22.02,18.83
  pour Route63: 18.26,18.88 21.49,18.88 21.49,14.76 18.26,14.76
BOOT  (via drill 0.35)
  Top 0.254: S1.1 49.31,6.29 C21.1 49.96,8.12 49.96,13.61 Q3.2 49.01,15.37 54.64,21.01 v56.26,21.01 | U3.8 64.77,35 65.77,34.01 v65.77,32.34
  Bottom 0.254: v56.26,21.01 59.21,21.01 64.92,26.73 64.92,31.5 v65.77,32.34
CHARCHING
  Top 0.2: R9.2 3.18,11.38 9.32,11.38 9.37,11.33 13.97,11.33 14.17,11.53 15.85,11.53 16.05,11.33 17.38,11.33 17.83,10.88 17.83,9.64 16.88,8.7 U1.6
CHARCHING_POWER_GOOD  (via drill 0.35)
  Top 0.2: R7.2 7.24,10.43 7.56,10.75 v8.48,10.75 | U1.7 15.54,9.23 15.61,9.3 15.61,10.12 15.41,10.32 v15.41,10.54
  Bottom 0.2: v8.48,10.75 14.97,10.75 15.19,10.54 v15.41,10.54
CHARGED  (via drill 0.35)
  Top 0.2: R8.2 5.08,10.34 5.87,9.54 8.26,9.54 8.36,9.64 v8.48,9.64 | U1.8 14.91,9.62 v14.98,9.69
  Bottom 0.2: v14.98,9.69 14.9,9.76 8.63,9.76 8.52,9.64 v8.48,9.64
CS  (via drill 0.35)
  Top 0.254: U6.1 46.38,40.37 TP5.1 52.15,40.37 v55.8,36.71 | U3.10 78.64,31.68 62.35,31.68 v61.52,32.52
  Bottom 0.254: v55.8,36.71 57,36.71 61.35,32.35 v61.52,32.52
CS_SD
  Top 0.254: U3.18 81.32,45.5 82.35,44.47 82.35,30.97 80.79,29.4 TP4.1 76.84,29.38 73.45,29.38 R19.1 72.92,26.82 J3.1
DTR  (via drill 0.35)
  Top 0.254: v42.34,12.53 41.85,12.04 R33.1 40.74,11.18 v40.72,11.21 | v46.79,16.82 47.93,16.82 Q3.3 | v32.77,25.35 32.77,25.37 32.46,25.68 30.4,25.68 30.16,25.44 U4.15
  Bottom 0.254: v46.79,16.82 46.33,16.82 45.95,16.44 45.95,15.55 45.11,14.71 45.14,14.71 42.95,12.53 v42.34,12.53 | v40.72,11.21 40.74,11.23 40.74,16.82 32.77,24.8 v32.77,25.35
EN  (via drill 0.35)
  Top 0.2: C22.1 41.76,7.45 R17.1
  Top 0.254: R17.1 39.75,3.84 40.49,3.1 S2.1 | v51.1,20.25 47.83,20.25 44.2,16.61 Q2.3 41.49,16.61 40.06,15.18 40.06,9.41 C22.1 | U3.2 63.04,43.92 64.31,43.92 69.39,38.84 v69.39,38.1
  Bottom 0.254: v51.1,20.25 51.21,20.35 60.02,20.35 69.39,29.72 v69.39,38.1
GND  (via drill 0.35)
  Top 0.2: 16.81,12.04 R1.2 | 18.28,12.1 v18.36,12.02 | 19.99,12.02 R2.2 | U1.10 13.66,7.89 U1.21 U1.3 v18.33,6.63 v18.34,6.64 | 13.21,12.04 R6.1 13.05,11.99 | 10.29,11.99 R5.1 | v14.99,12.17 14.93,12.12 14.93,12.04 | 19.32,49.42 v19.35,49.46 | J1.G1 33.52,11.02 33.54,11.04 34.15,11.04 34.17,11.02 J1.B1 | J1.B12 28.72,11.02 28.74,11.04 29.35,11.04 29.37,11.02 J1.G2 | U7.2 23.44,41.13 v23.42,41.1
  Top 0.254: J1.G4 J1.G3 32.2,7.69 v32.26,7.62 | v26.85,12.73 26.93,12.65 27.68,12.65 J1.A1 | J1.A12 34.7,11.47 J1.B1 | v37.08,9.89 37.06,9.87 | U5.2 30.66,18.78 v30.71,18.83
  Top 0.5: C6.2 v16.95,2.21 | 16.81,12.04 14.93,12.04 13.21,12.04 | R1.2 18.28,12.1 | v18.36,12.02 19.99,12.02 | 13.05,11.99 v11.63,11.99 10.29,11.99 | MK1.GND 13.41,47.02 C16.1 v15.74,48.57 | C19.2 19.32,49.42 | R29.2 21.16,40.67 22.69,39.15 C18.2 22.77,37.63 v22.83,37.57 | v45.04,7.45 C22.2 | S2.2 v44.6,1.63 | J3.G4 51.6,3.1 S1.2 v49.63,1.63 | C21.2 v46.38,7.47 | J1.S3 25.16,3.12 R3.2 | J1.S1 25.98,8.67 R4.2 | 37.06,9.87 J1.S2 | J1.S4 36.98,5.14 v37.03,5.08 | v33.81,18.37 33.81,17.11 C1.2 | R13.1 42.95,22.92 v43.03,22.84 | v40.77,28.07 40.77,26.92 C11.2 40.59,26.69 39.11,26.69 C9.2 36.35,25.42 C10.2 | U2.7 34.09,51.51 C15.2 32.23,50.83 v32.21,50.86 | U2.5 v36.02,52.18 | U2.1 v32.39,54.75 v32.38,54.74 | Q1.P$1 32.88,38.73 v32.87,38.71 | U6.4 43.61,33.95 C14.2 41.31,34.02 v40.11,34.02 | J3.G3 79.74,3.31 v78.16,3.31 | J3.9 77.09,26.69 J3.G2 78.93,24.92 v80.26,24.92 | C8.1 58.52,42 C7.2 56.58,42 v56.24,42.34 | U3.19 U3.28 U3.20 | U3.20 U3.29 U3.21 U3.32 U3.24 U3.37 U3.27 U3.39 U3.26 | U3.26 U3.38 U3.25 U3.35 U3.22 U3.33 U3.23 U3.34 | J5.5 12.25,52.86 v12.27,52.84 | J4.4 14.96,53.8 v14.93,53.78 | U3.9 63.04,33.58 v64.24,33.58 | v67.87,30.51 67.79,30.43 67.79,29.29 C13.1 67.89,28.99 67.89,26.85 J3.3 68.1,26.64 v68.1,25.35 | C12.2 60.67,28.94 60.67,26.81 J3.6 v60.55,25.33 | J3.8 57.02,26.73 v57.02,28.1 | J3.G1 51.77,24.77 v50.47,24.77 | U3.20 U3.31 | U3.36 U3.26 | R10.2 3.07,34.17 v2.03,34.17 | C5.2 4.15,29.05 v4.09,29.11
  pour Route2: -0.46,57.97 -0.46,-0.6 84,-0.6 84,57.97
  pour Top (isolate 0.254): 0.89,6.41 0.89,0.69 5.89,0.69 5.89,6.41
  pour Top (isolate 0.254): 13.44,7.55 12.37,7.55 12.37,9.33 13.87,9.33 13.87,8.13 13.44,8.13
  pour Top: 4.93,30.05 4.93,26.5 5.74,25.68 9.83,25.68 9.83,20.78 9.8,20.76 14.22,20.76 14.3,20.83 14.3,25.81 13.74,26.37 13.74,28.81 12.5,30.05
GPIO8  (via drill 0.35)
  Top 0.254: J5.2 8.42,50.73 28.98,50.73 31.5,48.21 38.96,48.21 45.04,42.14 52.4,42.14 53.63,40.91 v53.77,40.91 | U3.7 62.96,36.58 62.1,36.58 61.95,36.74 v61.59,36.74
  Bottom 0.254: v61.59,36.74 61.57,36.76 58.24,36.76 54.09,40.91 v53.77,40.91
GPIO18  (via drill 0.35)
  Top 0.254: J5.3 10.33,51.36 29.06,51.36 31.67,48.75 39.01,48.75 44.99,42.76 v53.07,42.76 | v66.32,37.19 66.34,37.19 66.9,36.63 76.96,36.63 78.25,37.92 80.37,37.92 U3.13
  Bottom 0.254: v66.32,37.19 66.32,37.39 58.45,37.39 54.91,40.94 54.89,40.94 v53.07,42.76
GPIO19  (via drill 0.35)
  Top 0.254: J5.4 9.71,53.72 11.53,51.9 29.45,51.9 32.09,49.26 39.24,49.26 44.68,43.82 52.68,43.82 v52.73,43.77 | U3.14 79.19,39.5 76.9,37.22 67.37,37.22 66.28,38.31 v65.79,38.31
  Bottom 0.254: v65.79,38.31 58.45,38.31 52.99,43.77 v52.73,43.77
MIC_OUT
  Top 0.2: U7.4 26.14,44.21 R31.2 26.43,43.91 C20.2 29.07,43.92 34.1,43.92 38.74,39.28 44.02,39.28 46.12,41.38 51.67,41.38 52.77,40.28 55.74,40.28 56.1,40.64 62.6,40.64 U3.4
MISO_DO  (via drill 0.35)
  Top 0.254: R16.2 52.82,31.45 R22.2 47.55,30.54 TP2.1 47.55,25.3 50.93,21.92 79.07,21.92 81.48,24.34 v81.48,27.79 | v81.43,31.53 81.49,31.58 81.49,41.9 80.88,42.5 U3.16
  Bottom 0.254: v81.43,31.53 81.43,27.84 v81.48,27.79
MOSI_DI
  Top 0.254: J3.2 70.55,30.83 70.2,31.17 61.77,31.17 60.81,32.14 60.81,34.89 R15.2 57.26,32.77 TP1.1 51.99,32.77 U6.5
N$1
  Top 0.254: R3.1 29.05,9.22 31.16,9.22 J1.B5
N$2
  Top 0.254: R4.1 24.08,6.83 23.65,7.27 23.65,11.6 26.07,14.02 29.51,14.02 30.44,13.09 J1.A5
N$3
  Top 0.2: U1.9 14.28,9.65 14.28,10.84 14.61,11.17 15.71,11.17 15.9,10.98 16.15,10.98 R1.1
N$4
  Top 0.2: U1.12 12.48,7.26 12.17,7.56 12.17,9.86 12.57,10.26 R6.2
N$5
  Top 0.2: U1.5 16.97,8.13 19,10.16 R2.1
N$6
  Top 0.2: U1.13 12.61,6.63 11.6,7.64 11.6,8.65 10.18,10.07 R5.2
N$7
  Top 0.254: R11.2 33.58,27.38 33.6,27.36 33.6,24.24 33,23.64 U4.9
N$8
  Top 0.254: R14.1 D6.C
N$9
  Top 0.254: R12.1 40.13,22.84 R13.2 | R13.2 40.05,24.4 C11.1 | U4.8 34.12,23.15 34.2,23.23 36.39,23.23 37.14,23.98 38.99,23.98 R13.2
N$10
  Top 0.2: D3.C 8.05,12.96 R7.1
N$11
  Top 0.2: D2.C 5.03,12.48 R8.1
N$12
  Top 0.254: R15.1 60.42,37.83 62.78,37.83 U3.6
N$13
  Top 0.2: D1.C 2.18,13.68 R9.1
N$14
  Top 0.2: C20.1 26.43,42.16 R31.1 24.26,42.11 U7.3 24.23,42.14 24.23,40.62 24.05,40.44 22.45,40.44 21.93,40.95 21.93,43.34 20.97,44.3 19.91,44.3 19.3,44.92 R30.2
N$15
  Top 0.254: D5.C R18.1
N$16
  Top 0.254: R14.2 27.36,22.65 U4.20
N$17
  Top 0.254: U4.19 28.74,23.15 28.26,23.63 24.34,23.63 24,23.29 R18.2
N$18
  Top 0.254: Q2.1 43.69,12.49 R33.2
N$19
  Top 0.254: R20.2 59.17,39.5 U3.5
N$20
  Top 0.254: R34.2 48.75,12.92 Q3.1
N$21
  Top 0.2: R28.2 17.71,46.8 C16.2 17.49,48.94 18.64,50.09 23.67,50.09 24.36,49.4 R26.1
N$22
  Top 0.254: J3.7 58.76,27.41 R16.1
N$23  (via drill 0.35)
  Top 0.2: v19.3,43.95 19.12,43.76 19.12,42.63 R29.1 18.41,41.51 C17.2 17.44,40.55 R27.2 | U7.1 22.79,42.72 22.34,43.17 22.34,43.91 v21.69,44.56
  Bottom 0.2: v19.3,43.95 20.07,44.71 21.54,44.71 v21.69,44.56
N$24
  Top 0.2: MK1.OUT 13.49,41.51 C17.1 15.68,44.04 R28.1
N$25
  Top 0.254: U6.2 43.74,36.41 46.62,33.54 R22.1
N$26
  Top 0.2: C19.1 21.14,48.12
  Top 0.254: 21.14,48.12 R30.1
PHOTO_C  (via drill 0.35)
  Top 0.254: R23.2 37.57,36.63 Q1.P$3 v40,38.18 | v54.89,38.84 56.31,40.26 v66.39,40.26 | v77.85,44.05 80.41,44.05 U3.17
  Bottom 0.254: v40,38.18 54.23,38.18 v54.89,38.84 | v66.39,40.26 70.18,44.05 v77.85,44.05
POWER_LED
  Top 0.2: R10.1 7.38,34.14 D4.C
RTS  (via drill 0.35)
  Top 0.254: R34.1 44.94,14.49 Q2.2 43.02,14.49 v42.62,14.89 | U4.16 29.43,24.67 29.34,24.77 29.34,26.07 29.64,26.37 30.52,26.37 v30.55,26.34
  Bottom 0.254: v42.62,14.89 41.86,15.65 41.86,17.25 32.74,26.37 30.59,26.37 v30.55,26.34
RX_TX  (via drill 0.35)
  Top 0.254: U4.17 29.36,24.17 28.93,24.6 28.93,26.42 30.86,28.35 34.04,28.35 36.13,30.43 v43.64,30.43 | U3.12 79.69,35.73 69.61,35.73 v68.6,34.73
  Bottom 0.254: v43.64,30.43 62.66,30.43 65.23,33 66.88,33 v68.6,34.73
SCL  (via drill 0.35)
  Top 0.254: J4.3 21.72,56.26 33.56,56.32 34.49,56.32 35.39,55.42 U2.4 35.56,54.58 R24.2 38.77,55.65 42.18,55.65 43.7,54.14 43.7,46.67 44.87,45.5 v51.8,45.5 | v66.73,45.19 66.76,45.23 70.93,45.23 75.16,41 U3.15
  Bottom 0.254: v51.8,45.5 51.81,45.51 66.41,45.51 v66.73,45.19
SCLK  (via drill 0.35)
  Top 0.254: U6.6 53.85,35.14 TP3.1 54.4,35.68 R20.1 v57.25,34.12 | J3.5 63.05,25.74 61.59,24.29 60.25,24.29 59.54,25 59.54,27.56 58.27,28.83 v58.27,32.49
  Bottom 0.254: v57.25,34.12 57.25,33.5 v58.27,32.49
SDA  (via drill 0.35)
  Top 0.254: J4.2 21.8,54.23 23.28,55.71 34.14,55.76 34.74,55.16 U2.3 34.89,54.6 34.89,54.42 35.55,53.75 39.78,53.75 40.51,54.48 R25.2 42.06,54.59 42.8,53.84 42.8,46.46 44.62,44.64 54.67,44.64 v54.7,44.67 | v61.37,42.35 62.8,42.35 U3.3
  Bottom 0.254: v61.37,42.35 58.75,44.96 54.99,44.96 v54.7,44.67
TX_RX  (via drill 0.35)
  Top 0.254: U4.18 29.29,23.72 28.8,23.72 28.52,23.99 28.52,28.61 31.32,31.4 43.79,31.4 v44.17,31.78 | U3.11 80.23,35 79.15,33.92 v66.46,33.92
  Bottom 0.254: v44.17,31.78 44.22,31.73 63.32,31.73 65.1,33.51 66.05,33.51 v66.46,33.92
USB_D+
  Top 0.254: U5.3 29.71,19.58 31.17,21.04 U4.4
USB_D-
  Top 0.254: U5.1 31.61,21.79 U4.5
USB_DN  (via drill 0.35)
  Top 0.254: v32.74,14.21 32.74,14.61 32.32,15.03 U5.6 31.61,14.75 32.25,14.11 32.25,13.47 31.69,12.91 J1.A7
  Bottom 0.254: v32.74,14.21 32.74,13.59 31.04,11.9 J1.B7
USB_DP  (via drill 0.35)
  Top 0.254: v28.75,14.69 28.83,14.69 29.17,15.03 U5.4 29.71,14.39 31.07,13.03 J1.A6
  Route63 0.2: J1.B6 31.8,11.06 31.8,11.33
  Route63 0.254: 31.8,11.33 31.36,11.77 31.35,11.77 28.75,14.38 v28.75,14.69
VBAT
  Top 0.5: P1.2 11.4,3.51 12.34,4.45
  pour Top (isolate 0.254): 11.73,6.2 13.49,6.2 13.49,5.14 13.92,5.14 13.92,3.92 11.73,3.92
VBUS  (via drill 0.35)
  Top 0.2: J1.A4 29.79,12.41 29.79,13.05 29.38,13.46 26.41,13.46 26.06,13.12 26.06,12.38 v25.6,11.92 | J1.B4 32.64,11.47 32.96,11.78 32.96,12.38 J1.A9 | 29.83,12.38 29.83,11.79 30.24,11.38 J1.B9
  Top 0.254: C1.1 36.94,15.33 41.97,20.36 R12.2 42.04,20.5 v43.03,20.5 | 30.66,14.38 31.24,13.79 v31.42,13.79 | J1.A4 29.83,12.38 | v33.98,13.82 33.71,13.82 33.15,13.27 33.13,13.27 32.95,13.09 J1.A9
  Top 0.5: C1.1 33.71,15.46 33.43,15.46 32.72,16.17 31.02,16.17 30.66,15.8 U5.5 30.66,14.38
  other vias: 25.04,17.94 25.09,16.72 25.04,15.35
  pour Top: 22.66,18.6 22.66,14.48 25.7,14.48 25.73,14.51 25.73,18.57 25.75,18.6
  pour Route63 (isolate 0.254): 22.45,18.8 22.45,9.61 26.31,9.61 26.95,8.97 34.44,8.97 35.71,10.24 35.71,13.57 34.92,14.36 32.69,14.36 32.69,18.11 32,18.8